# Altium schematic sheet ServoSurucuSematik.SchDoc
size A4
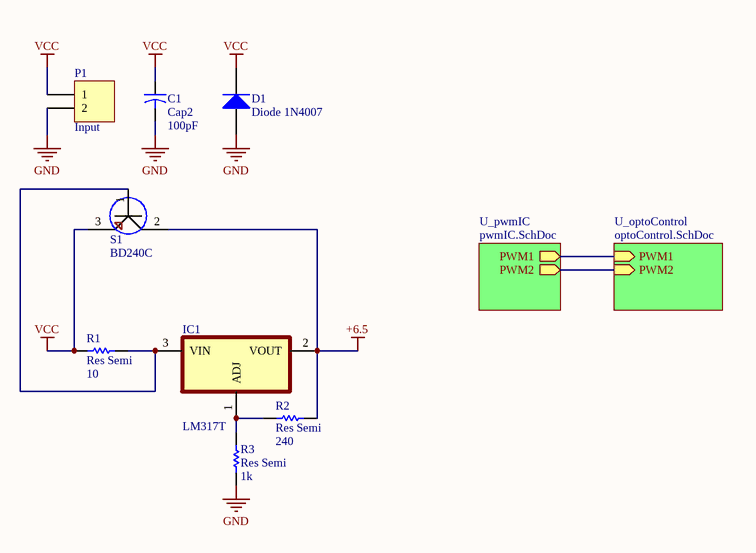
[diagram p0: ServoSurucuSematik.SchDoc]

## Parts
C1  Cap2  value 100pF  [CAPR5-4X5]
D1  Diode 1N4007  [DO-41]
IC1  LM317T  [LM317]
P1  Input  [HDR1X2]
R1  Res Semi  value 10  [AXIAL-0.5]
R2  Res Semi  value 240  [AXIAL-0.5]
R3  Res Semi  value 1k  [AXIAL-0.5]
S1  BD240C  [BD240C]

## Sub-sheets
U_optoControl = optoControl.SchDoc: PWM1 (in), PWM2 (in)
U_pwmIC = pwmIC.SchDoc: PWM1 (out), PWM2 (out)

## Nets
+6.5: IC1.2(VOUT) R2.1 S1.2
GND: C1.2 D1.1(A) P1.2 R3.2
VCC: C1.1 D1.2(K) P1.1 R1.2 S1.3
NetIC1_1: IC1.1(ADJ) R2.2 R3.1
NetIC1_3: IC1.3(VIN) R1.1 S1.1
(unnamed): sheet U_pwmIC/PWM1, sheet U_optoControl/PWM1
(unnamed): sheet U_pwmIC/PWM2, sheet U_optoControl/PWM2

## Library data of the parts
C1 = Cap2: Capacitor; Published: 23-Sep-2002; PackageReference: CAPR5-4X5; Publisher: Altium Limited; PackageDescription: Capacitor; 2 Leads
D1 = Diode 1N4007: 1 Amp General Purpose Rectifier; Published: 8-Jun-2000; LatestRevisionDate: 17-Jul-2002; LatestRevisionNote: Re-released for DXP Platform.; DatasheetVersion: 1998; PackageVersion: Aug-1999; PackageReference: DO-41; Publisher: Altium Limited; PackageDescription: Diode, Axial; Body 5.2 x 2.7 mm (LxDia. max), Lead Dia. 0.86 mm (max); Code_JEDEC: DO-204-AL; ComponentLink1Description: Manufacturer Link; ComponentLink1URL: http://www.fairchildsemi.com/; ComponentLink2Description: Datasheet; ComponentLink2URL: http://www.fairchildsemi.com/ds/1N%2F1N4001.pdf
IC1 = LM317T: 1.5-A, 40-V, adjustable linear voltage regulator 3-TO-220; MF: Texas Instruments; Arrow_Electronics-Purchase-URL: https://snapeda.com/shop?store=Arrow+Electronics&id=2756289; Price: None; Value: *; Availability: Unavailable; DigiKey-Purchase-URL: https://snapeda.com/shop?store=DigiKey&id=2756289; Mouser-Purchase-URL: https://snapeda.com/shop?store=Mouser&id=2756289; SnapEDA_Link: https://www.snapeda.com/parts/LM317T/Texas%20Instruments/view-part/2756289/?ref=snap; MP: LM317T; Package: TO-220-3 Texas Instruments
P1 = Header 2: Header, 2-Pin; LatestRevisionDate: 17-Jul-2002; LatestRevisionNote: Re-released for DXP Platform.; Publisher: Altium Limited
R1-R3 = Res Semi: Semiconductor Resistor; Published: 8-Jun-2000; LatestRevisionDate: 17-Jul-2002; LatestRevisionNote: Re-released for DXP Platform.; PackageReference: AXIAL-0.5; Publisher: Altium Limited; PackageDescription: Axial Device, Thru-Hole; 2 Leads; 0.5 in Pin Spacing
S1 = BD240C: TO 220